# EAGLE design Celda interna (EAGLE 7.6.0)
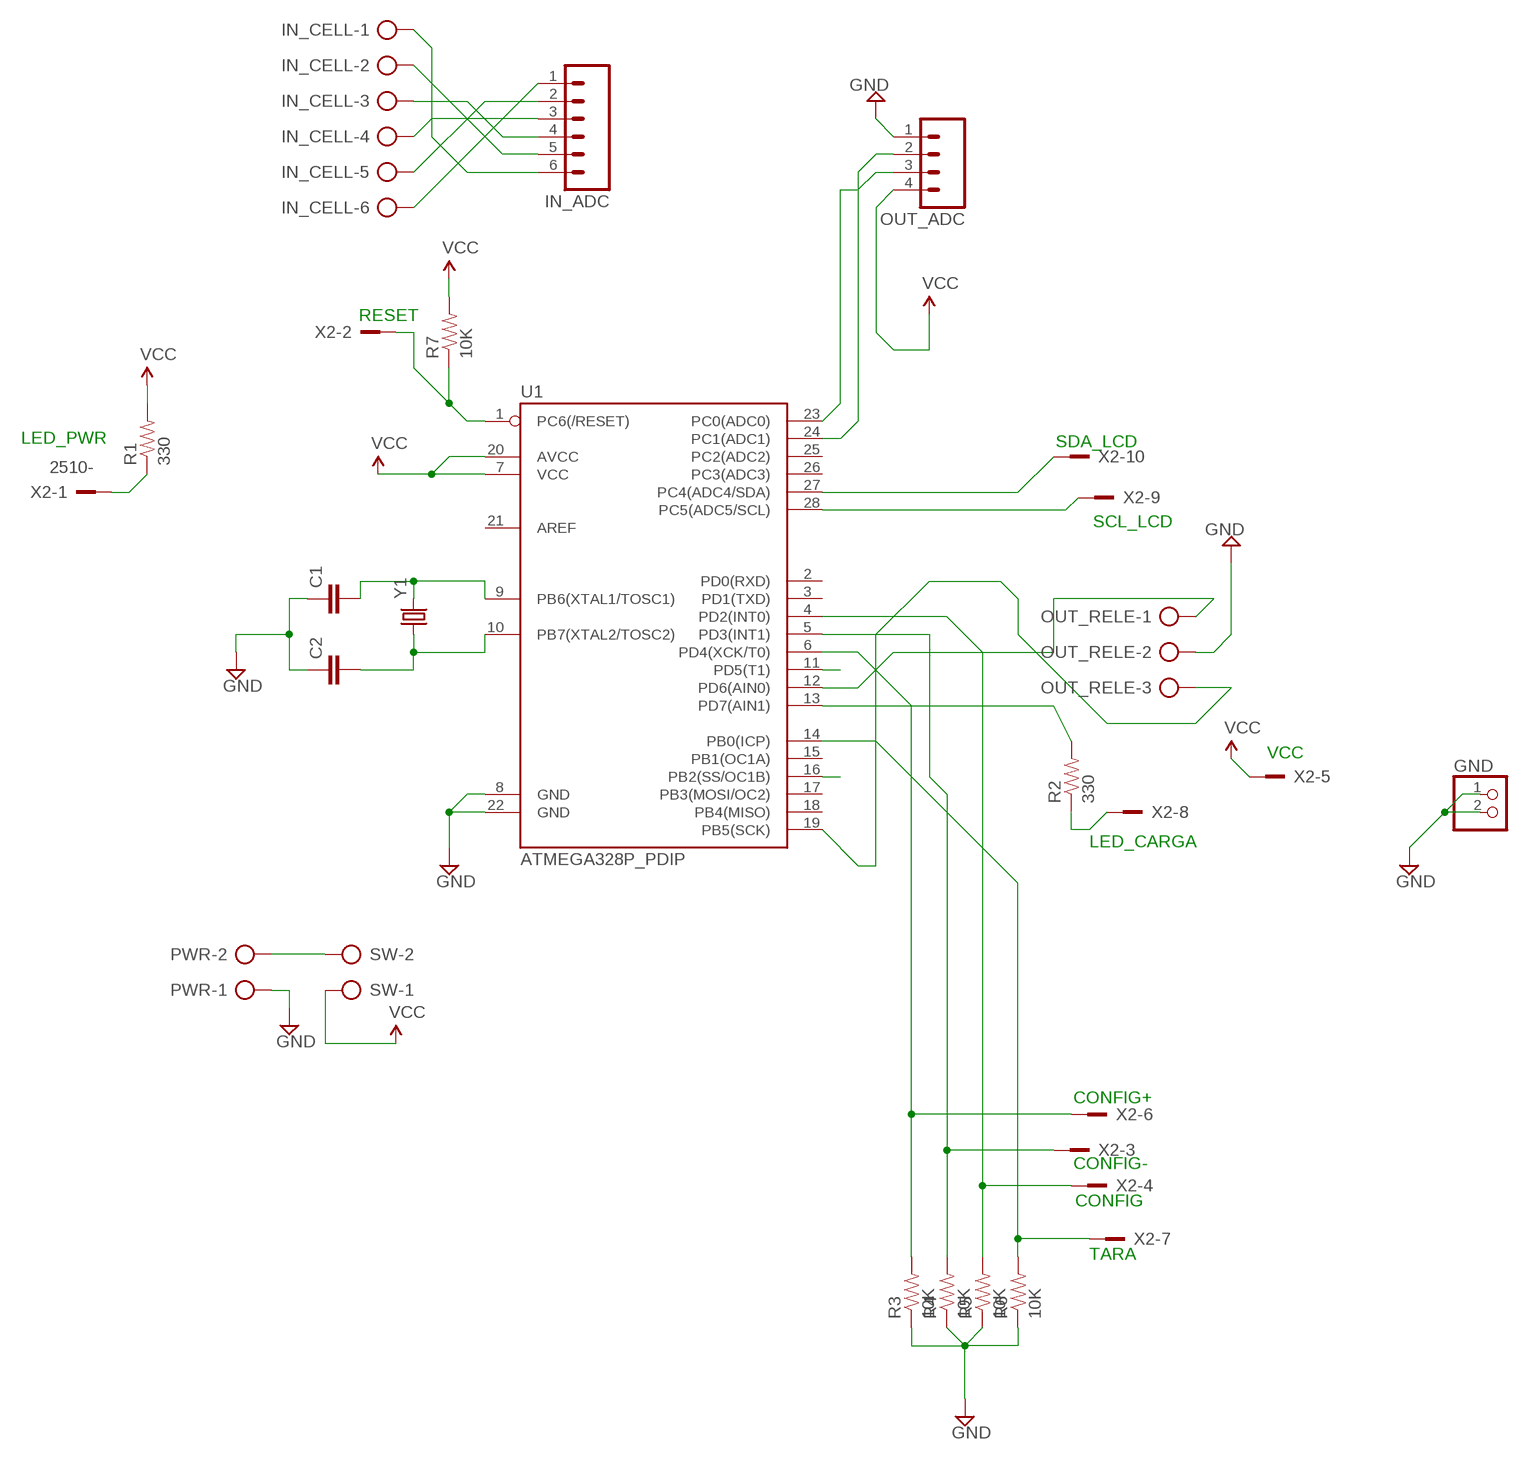
[diagram p0: schematic, sheet 1]

## Parts
C1  CAPKIT  [CAP-PTH-SMALL-KIT]
C2  CAPKIT  [CAP-PTH-SMALL-KIT]
GND  PINHD-1X2  [1X02]
IN_ADC  M06LONGPADS  [1X06_LONGPADS]
IN_CELL  AK500/6  [AK500/6]
OUT_ADC  M04LONGPADS  [1X04_LONGPADS]
OUT_RELE  AK500/3  [AK500/3]
PWR  AK500/2  [AK500/2]
R1  330  RESISTORPTH-1/4W  [AXIAL-0.4]
R2  330  RESISTORPTH-1/4W  [AXIAL-0.4]
R3  10K  RESISTORPTH-1/4W  [AXIAL-0.4]
R4  10K  RESISTORPTH-1/4W  [AXIAL-0.4]
R5  10K  RESISTORPTH-1/4W  [AXIAL-0.4]
R6  10K  RESISTORPTH-1/4W  [AXIAL-0.4]
R7  10K  RESISTORPTH-1/4W  [AXIAL-0.4]
SW  AK500/2  [AK500/2]
U1  ATMEGA328P_PDIP  [DIL28-3]
X2  2510-  [PAK100/2500-10]
Y1  CRYSTALHC49US  [HC49US]

## Nets
GND: C1.1 C2.1 GND.1 GND.2 OUT_ADC.1 OUT_RELE.2 PWR.1 R3.P$1 R4.P$1 R5.P$1 R6.P$1 U1.8(GND) U1.22(GND)
N$1: U1.28(PC5(ADC5/SCL)) X2.9
N$2: U1.27(PC4(ADC4/SDA)) X2.10
N$3: IN_ADC.1 IN_CELL.6
N$4: IN_ADC.2 IN_CELL.5
N$5: OUT_ADC.2 U1.24(PC1(ADC1))
N$6: OUT_ADC.3 U1.23(PC0(ADC0))
N$7: IN_ADC.3 IN_CELL.4
N$8: IN_ADC.4 IN_CELL.3
N$9: IN_ADC.5 IN_CELL.2
N$10: IN_ADC.6 IN_CELL.1
N$11: R3.P$2 U1.6(PD4(XCK/T0)) X2.6
N$12: R1.P$1 X2.1
N$13: OUT_RELE.1 U1.12(PD6(AIN0))
N$14: C1.2 U1.9(PB6(XTAL1/TOSC1)) Y1.2
N$15: R2.P$1 X2.8
N$16: R2.P$2 U1.13(PD7(AIN1))
N$17: R4.P$2 U1.5(PD3(INT1)) X2.3
N$18: R5.P$2 U1.4(PD2(INT0)) X2.4
N$19: R6.P$2 U1.14(PB0(ICP)) X2.7
N$20: R7.P$1 U1.1(PC6(/RESET)) X2.2
N$21: PWR.2 SW.2
N$22: U1.11(PD5(T1))
N$23: OUT_RELE.3 U1.19(PB5(SCK))
N$24: U1.16(PB2(SS/OC1B))
N$25: C2.2 U1.10(PB7(XTAL2/TOSC2)) Y1.1
VCC: OUT_ADC.4 R1.P$2 R7.P$2 SW.1 U1.7(VCC) U1.20(AVCC) X2.5
Unconnected: U1.2(PD0(RXD)) U1.3(PD1(TXD)) U1.15(PB1(OC1A)) U1.17(PB3(MOSI/OC2)) U1.18(PB4(MISO)) U1.21(AREF) U1.25(PC2(ADC2)) U1.26(PC3(ADC3))

## Notes on the sheet
- RESET
- LED_PWR | SDA_LCD
- SCL_LCD
- VCC
- LED_CARGA
- CONFIG+
- CONFIG-
- CONFIG
- TARA

## Library data of the parts
C1 C2 = SparkFun-Capacitors:CAP: Capacitor Standard 0603 ceramic capacitor, and 0.1" leaded capacitor.
GND = pinhead:PINHD-1X2: PIN HEADER
IN_ADC = SparkFun-Connectors:M06: Header 6 Standard 6-pin 0.1" header. Use with straight break away headers (SKU : PRT-00116), right angle break away headers (PRT-00553), swiss pins (PRT-00743), machine pins (PRT-00117), and female headers (PRT-00115). Molex polarized connector foot print use with SKU : PRT-08094 with associated crimp pins and housings. NOTES ON THE VARIANTS LOCK and LOCK_LONGPADS... This footprint was designed to help hold the alignment of a through-hole component (i.e. 6-pin header) while soldering it into place. You may notice that each hole has been shifted either up or down by 0.005 of an inch from it's more standard position (which is a perfectly straight line). This slight alteration caused the pins (the squares in the middle) to touch the edges of the holes. Because they are alternating, it causes a "brace" to hold the component in place. 0.005 has proven to be the perfect amount of "off-center" position when using our standard breakaway headers. Although looks a little odd when you look at the bare footprint, once you have a header in there, the alteration is very hard to notice. Also,if you push a header all the way into place, it is covered up entirely on the bottom side. This idea of altering the position of holes to aid alignment will be further integrated into the Sparkfun Library for other footprints. It can help hold any component with 3 or more connection pins.
IN_CELL = con-ptr500:AK500/6: CONNECTOR; OC_FARNELL: unknown; OC_NEWARK: unknown
OUT_ADC = SparkFun-Connectors:M04: Header 4 Standard 4-pin 0.1" header. Use with straight break away headers (SKU : PRT-00116), right angle break away headers (PRT-00553), swiss pins (PRT-00743), machine pins (PRT-00117), and female headers (PRT-00115). Molex polarized connector foot print use with SKU : PRT-08231 with associated crimp pins and housings. 1MM SMD Version SKU: PRT-10208
OUT_RELE = con-ptr500:AK500/3: CONNECTOR; OC_FARNELL: unknown; OC_NEWARK: unknown
PWR SW = con-ptr500:AK500/2: CONNECTOR; OC_FARNELL: unknown; OC_NEWARK: unknown
R1-R7 = SparkFun-Passives:RESISTOR: Resistor Basic schematic elements and footprints for 0603, 1206, and PTH resistors.
U1 = SparkFun-DigitalIC:ATMEGA328P_PDIP: uC used in the Arduino 32kb flash, 1k EEPROM, 2k SRAM This is the through-hole version of this chip.
X2 = con-3m:2510-: 3M (TM) Pak 100 4-Wall Header Source: 3M; MF: 3M; MPN: 2510-6002UB; OC_FARNELL: 9838244; OC_NEWARK: 46F4725
Y1 = SparkFun-FreqCtrl:CRYSTAL: Various standard crystals. Proven footprints.

## Board
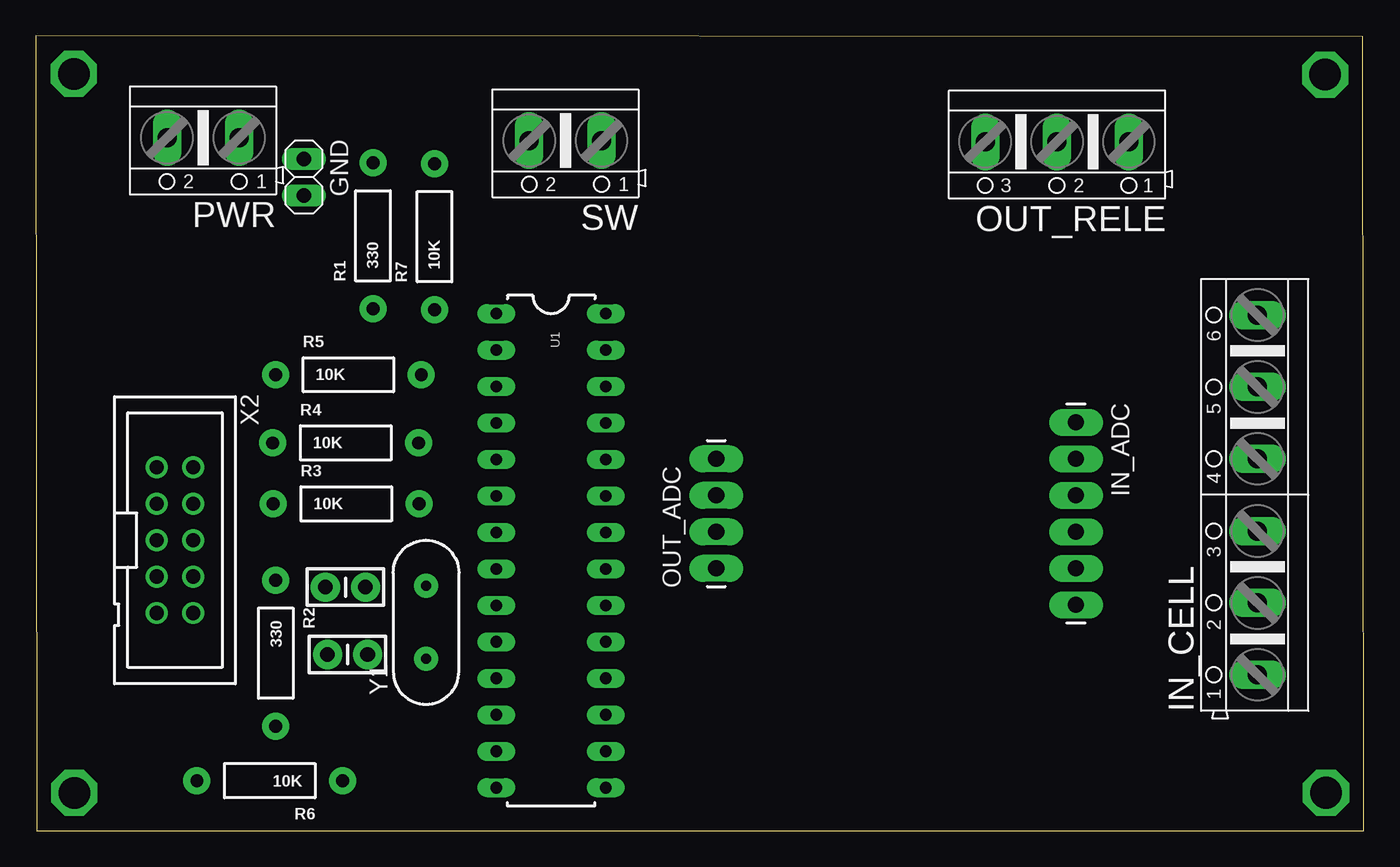
[diagram p1: board, top side]
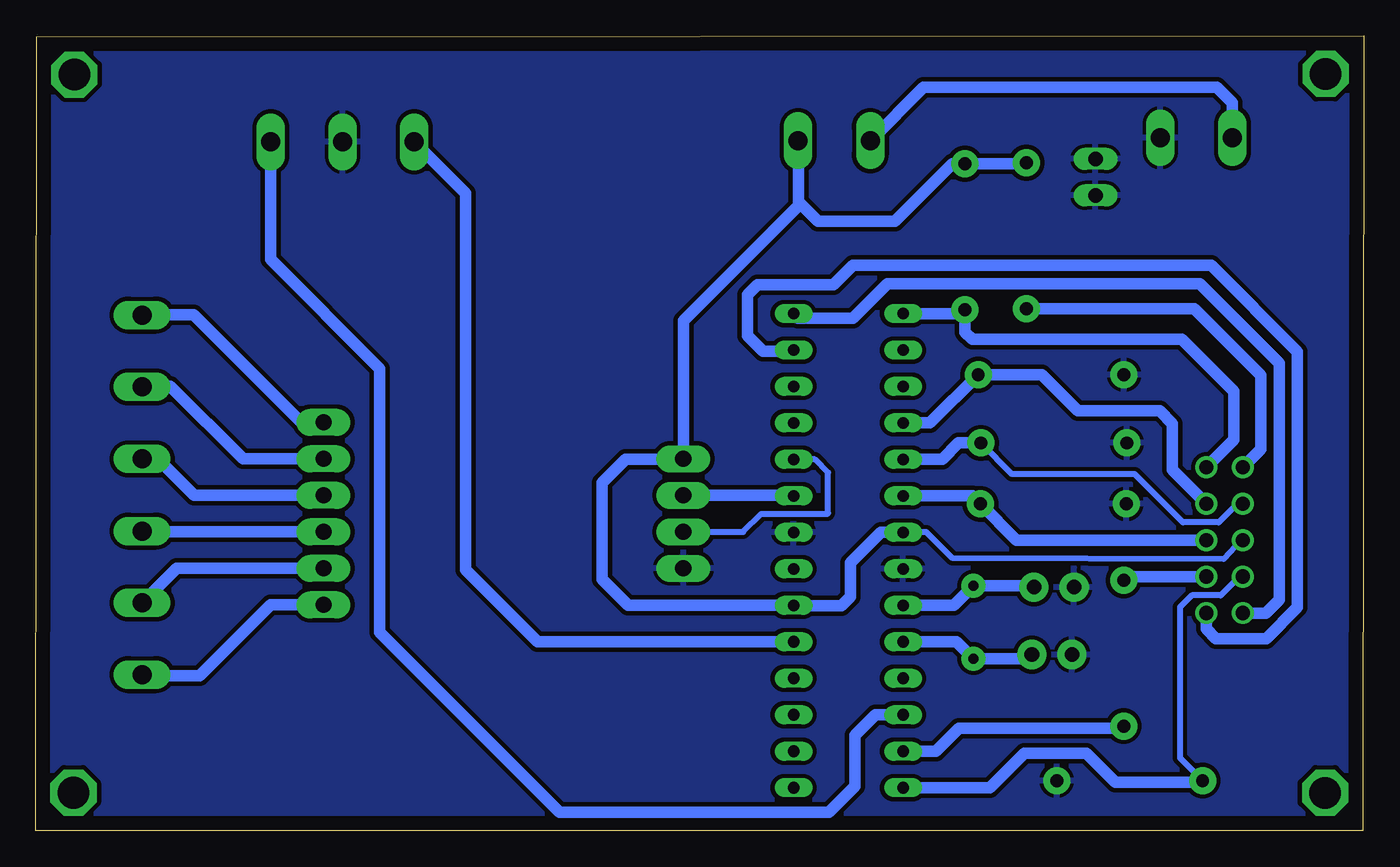
[diagram p2: board, bottom side, seen from below]

Size 92.49 x 55.35 mm. Coordinates in mm from the lower left corner, seen from the top.
Outline: 0.07,0 92.49,0.01 92.42,55.28 0,55.35 0.07,0
Copper layers (1*16): Top 0.035mm / dielectric 1.5mm / Bottom 0.035mm
Design rules "default *": minimum track width 24mil, minimum drill 24mil, track to track 12mil, track to pad 12mil, pad to pad 8mil, via to via 8mil, smd to smd 8mil, copper to edge 40mil, drill to drill 8mil, minimum pad ring 10mil, minimum via ring 8mil, stop-mask expansion 4mil, vias tented up to drill 0mil, thermal gap 10mil

### Footprints (pad centres in the part's own frame; a part is rotated, then mirrored left to right if it is on the bottom)
CAP-PTH-SMALL-KIT = drill 1.016 pad 2.032: 1 -1.397,0; 2 1.397,0
1X02 = drill 1.016 long: 1 -1.27,0; 2 1.27,0
1X06_LONGPADS = drill 1.118 pad 1.88 long: 1 0,0; 2 2.54,0; 3 5.08,0; 4 7.62,0; 5 10.16,0; 6 12.7,0
AK500/6 = drill 1.321 long: 1 -12.522,0; 2 -7.518,0; 3 -2.515,0; 4 2.515,0; 5 7.518,0; 6 12.522,0
1X04_LONGPADS = drill 1.118 pad 1.88 long: 1 0,0; 2 2.54,0; 3 5.08,0; 4 7.62,0
AK500/3 = drill 1.321 long: 1 -5.004,0; 2 0,0; 3 5.004,0
AK500/2 = drill 1.321 long: 1 -2.515,0; 2 2.515,0
AXIAL-0.4 = drill 0.9 pad 1.88: P$1 -5.08,0; P$2 5.08,0
DIL28-3 = drill 0.813 long: 1 -16.51,-3.81; 2 -13.97,-3.81; 3 -11.43,-3.81; 4 -8.89,-3.81; 5 -6.35,-3.81; 6 -3.81,-3.81; 7 -1.27,-3.81; 8 1.27,-3.81; 9 3.81,-3.81; 10 6.35,-3.81; 11 8.89,-3.81; 12 11.43,-3.81; 13 13.97,-3.81; 14 16.51,-3.81; 15 16.51,3.81; 16 13.97,3.81; 17 11.43,3.81; 18 8.89,3.81; 19 6.35,3.81; 20 3.81,3.81; 21 1.27,3.81; 22 -1.27,3.81; 23 -3.81,3.81; 24 -6.35,3.81; 25 -8.89,3.81; 26 -11.43,3.81; 27 -13.97,3.81; 28 -16.51,3.81
PAK100/2500-10 = drill 1 pad 1.422: 1 -5.08,-1.27; 2 -5.08,1.27; 3 -2.54,-1.27; 4 -2.54,1.27; 5 0,-1.27; 6 0,1.27; 7 2.54,-1.27; 8 2.54,1.27; 9 5.08,-1.27; 10 5.08,1.27
HC49US = drill 0.7 pad 1.651: 1 -2.54,0; 2 2.54,0

### Placement (x,y rotation side)
C1  21.57,16.97 0 top
C2  21.71,12.27 0 top
GND  18.67,45.51 270 top
IN_ADC  72.45,28.44 270 top
IN_CELL  85.09,23.39 90 top
OUT_ADC  47.39,18.28 90 top
OUT_RELE  71.13,47.98 180 top
PWR  11.65,48.26 180 top
R1  23.48,41.43 90 top
R2  16.71,12.37 270 top
R3  21.62,22.76 0 top
R4  21.58,27.01 0 top
R5  21.77,31.76 0 top
R6  16.3,3.5 180 top
R7  27.77,41.37 90 top
SW  36.88,48.06 180 top
U1  35.89,19.51 270 top
X2  9.69,20.24 270 top
Y1  27.18,14.52 90 top

### Tracks (layer width: path | path; a pad name or v marks a point on that pad's centre or on a via)
GND
  pour Bottom: 0.07,-0.5 0.07,54.74 92.47,55.24 92.47,0
N$1
  Bottom 0.813: X2.9 6.81,15.16 5.89,16.08 5.89,32.55 11.43,38.09 33.19,38.09 35.57,35.7 39.39,35.7 U1.28
N$2
  Bottom 0.813: X2.10 10.96,14.06 10.29,13.39 6.78,13.39 4.62,15.55 4.62,33.37 10.62,39.38 35.57,39.38 36.93,38.01 42.24,38.01 42.92,37.33 42.92,34.47 41.84,33.39 39.79,33.39 U1.27
N$3
  Bottom 0.813: IN_ADC.1 74,28.44 81.49,35.93 85.08,35.93 IN_CELL.6
N$4
  Bottom 0.813: IN_ADC.2 78.07,25.9 83.12,30.95 85.05,30.95 IN_CELL.5
N$5
  Bottom 0.406: OUT_ADC.2 43.22,20.82 41.96,22.08 37.36,22.08 37.3,22.14 37.3,24.94 38.22,25.86 U1.24
N$6
  Bottom 0.813: OUT_ADC.3 39.74,23.36 U1.23
N$7
  Bottom 0.813: IN_ADC.3 81.45,23.36 84.03,25.94 85.06,25.94 IN_CELL.4
N$8
  Bottom 0.813: IN_ADC.4 85.04,20.82 IN_CELL.3
N$9
  Bottom 0.813: IN_ADC.5 82.69,18.28 IN_CELL.2
N$10
  Bottom 0.813: IN_ADC.6 76.13,15.74 81.09,10.78 85.01,10.78 IN_CELL.1
N$11
  Bottom 0.813: U1.6 27.25,23.32 R3.P$2 24.17,20.24 X2.6
N$12
  Bottom 0.813: R1.P$1 11.8,36.35 7.16,31.71 7.16,26.57 X2.1
N$13
  Bottom 0.813: OUT_RELE.1 76.13,39.79 68.53,32.18 68.53,13.82 56.01,1.31 37.24,1.31 35.43,3.12 35.43,6.64 34,8.07 32.09,8.07 U1.12
N$14
  Bottom 0.813: U1.9 28.54,15.7 Y1.2 23.06,17.06 C1.2
N$15
  Bottom 0.813: X2.8 16.47,17.7 R2.P$1
N$16
  Bottom 0.813: U1.13 29.79,5.54 28.18,7.15 16.85,7.15 R2.P$2
N$17
  Bottom 0.406: X2.3 8.81,22.78 10.1,21.49 12.59,21.49 15.95,24.84 24.49,24.84 R4.P$2
  Bottom 0.813: R4.P$2 28.21,27.01 29.33,25.89 32.05,25.89 U1.5
N$18
  Bottom 0.813: U1.4 30.21,28.4 R5.P$2 22.42,31.76 19.91,29.24 14.19,29.24 13.31,28.36 13.31,25.13 X2.4
N$19
  Bottom 0.406: X2.7 8.64,17.7 9.95,16.39 11.98,16.39 12.8,15.57 12.8,5.08 R6.P$2
  Bottom 0.813: U1.14 26.04,3 23.63,5.41 19.32,5.41 17.29,3.38 11.33,3.38 R6.P$2
N$20
  Bottom 0.813: U1.1 28.04,36.02 R7.P$1 27.77,34.73 27.25,34.21 12.65,34.21 9.03,30.59 9.03,27.24 X2.2
N$21
  Bottom 0.813: PWR.2 9.16,50.7 10.24,51.78 30.68,51.78 SW.2
N$23
  Bottom 0.813: U1.19 57.53,13.16 62.54,18.17 62.54,44.39 OUT_RELE.3
N$25
  Bottom 0.813: U1.10 28.35,13.16 Y1.1 23.39,11.98 C2.2
N$26  (via drill 2.2 pad 1.27)
  other vias: 2.64,52.71
N$27  (via drill 2.2 pad 1.27)
  other vias: 2.67,2.65
N$28  (via drill 2.2 pad 1.27)
  other vias: 89.87,2.65
N$29  (via drill 2.2 pad 1.27)
  other vias: 89.81,52.66
VCC
  Bottom 0.406: X2.5 8.51,20.24 9.75,18.93 28.64,18.98 30.46,20.79 32.07,20.79 U1.7
  Bottom 0.813: U1.7 33.64,20.78 35.76,18.66 35.76,16.29 36.36,15.69 39.69,15.69 U1.20 51.25,15.7 53.06,17.51 53.06,24.24 51.42,25.89 47.41,25.89 OUT_ADC.4 47.39,35.51 39.22,43.68 | R1.P$2 23.54,46.45 R7.P$2 28.64,46.45 32.64,42.46 38,42.46 39.22,43.68 | 39.22,43.68 39.38,43.84 39.38,48.05 SW.1

### Text on the board
200bmp: C:/Users/Jose/Pictures/JoseM.bmp